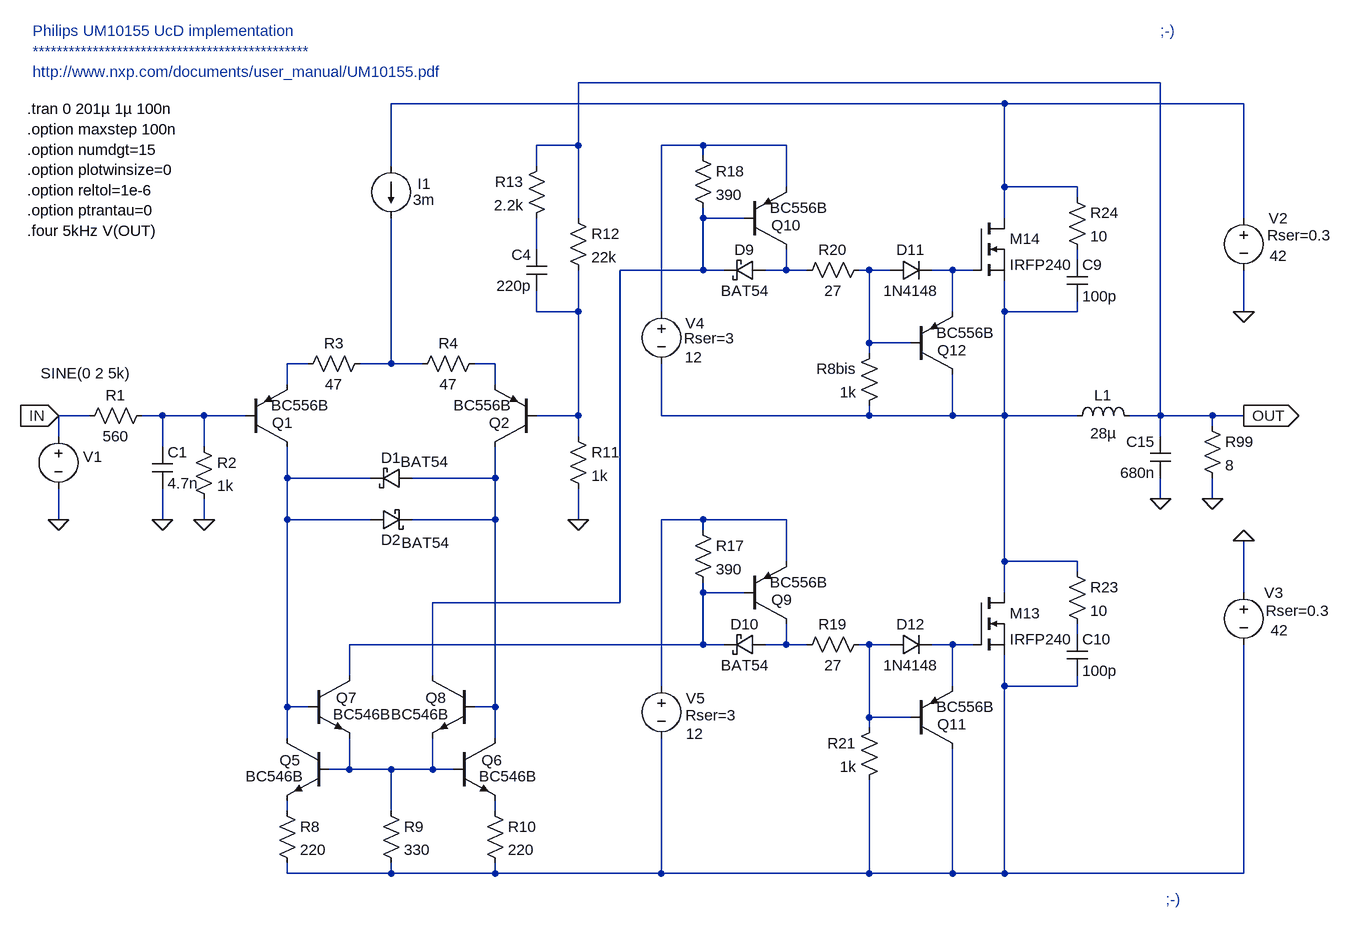
[diagram p0: schematic UcD simplified (5kHz .tran 0 201µ 1µ 100n).asc]
UcD simplified (5kHz .tran 0 201µ 1µ 100n).asc, the LTspice schematic file:
Version 4
SHEET 1 2660 1008
WIRE 1120 -352 224 -352
WIRE 880 -320 -64 -320
WIRE 1248 -320 880 -320
WIRE 224 -256 224 -352
WIRE 224 -256 160 -256
WIRE 416 -256 352 -256
WIRE 544 -256 416 -256
WIRE 416 -240 416 -256
WIRE -64 -224 -64 -320
WIRE 160 -224 160 -256
WIRE 544 -192 544 -256
WIRE 880 -192 880 -320
WIRE 992 -192 880 -192
WIRE 992 -176 992 -192
WIRE 224 -144 224 -256
WIRE 416 -144 416 -160
WIRE 480 -144 416 -144
WIRE 880 -144 880 -192
WIRE 1248 -144 1248 -320
WIRE 160 -96 160 -144
WIRE 992 -80 992 -96
WIRE 416 -64 416 -144
WIRE 416 -64 288 -64
WIRE 448 -64 416 -64
WIRE 544 -64 544 -96
WIRE 544 -64 512 -64
WIRE 576 -64 544 -64
WIRE 672 -64 656 -64
WIRE 704 -64 672 -64
WIRE 800 -64 768 -64
WIRE 832 -64 800 -64
WIRE 160 0 160 -32
WIRE 224 0 224 -64
WIRE 224 0 160 0
WIRE 352 0 352 -256
WIRE 800 0 800 -64
WIRE 880 0 880 -48
WIRE 992 0 992 -16
WIRE 992 0 880 0
WIRE 1248 0 1248 -64
WIRE 672 48 672 -64
WIRE 736 48 672 48
WIRE 672 64 672 48
WIRE -192 80 -224 80
WIRE -64 80 -64 -144
WIRE -64 80 -112 80
WIRE -16 80 -64 80
WIRE 96 80 64 80
WIRE -224 112 -224 80
WIRE 96 112 96 80
WIRE -528 160 -576 160
WIRE -416 160 -448 160
WIRE -352 160 -416 160
WIRE -288 160 -352 160
WIRE 224 160 224 0
WIRE 224 160 160 160
WIRE 352 160 352 80
WIRE 672 160 672 144
WIRE 672 160 352 160
WIRE 800 160 800 96
WIRE 800 160 672 160
WIRE 880 160 880 0
WIRE 880 160 800 160
WIRE 992 160 880 160
WIRE 1120 160 1120 -352
WIRE 1120 160 1072 160
WIRE 1200 160 1120 160
WIRE 1248 160 1200 160
WIRE 1200 176 1200 160
WIRE -576 192 -576 160
WIRE 224 192 224 160
WIRE 1120 192 1120 160
WIRE -416 208 -416 160
WIRE -352 208 -352 160
WIRE -224 256 -224 208
WIRE -96 256 -224 256
WIRE 96 256 96 208
WIRE 96 256 -32 256
WIRE 1120 288 1120 256
WIRE 1200 288 1200 256
WIRE -576 320 -576 272
WIRE -416 320 -416 272
WIRE -352 320 -352 288
WIRE -224 320 -224 256
WIRE -96 320 -224 320
WIRE 96 320 96 256
WIRE 96 320 -32 320
WIRE 224 320 224 272
WIRE 416 320 352 320
WIRE 544 320 416 320
WIRE 416 336 416 320
WIRE 544 384 544 320
WIRE 880 384 880 160
WIRE 992 384 880 384
WIRE 992 400 992 384
WIRE 416 432 416 416
WIRE 480 432 416 432
WIRE 880 432 880 384
WIRE 1248 432 1248 352
WIRE 288 448 288 -64
WIRE 288 448 0 448
WIRE 992 496 992 480
WIRE 416 512 416 432
WIRE 416 512 -128 512
WIRE 448 512 416 512
WIRE 544 512 544 480
WIRE 544 512 512 512
WIRE 576 512 544 512
WIRE 672 512 656 512
WIRE 704 512 672 512
WIRE 800 512 768 512
WIRE 832 512 800 512
WIRE -128 560 -128 512
WIRE 0 560 0 448
WIRE 352 576 352 320
WIRE 800 576 800 512
WIRE 880 576 880 528
WIRE 992 576 992 560
WIRE 992 576 880 576
WIRE -224 608 -224 320
WIRE -192 608 -224 608
WIRE 96 608 96 320
WIRE 96 608 64 608
WIRE 672 624 672 512
WIRE 736 624 672 624
WIRE 672 640 672 624
WIRE -224 656 -224 608
WIRE 96 656 96 608
WIRE -128 704 -128 656
WIRE -128 704 -160 704
WIRE -64 704 -128 704
WIRE 0 704 0 656
WIRE 0 704 -64 704
WIRE 32 704 0 704
WIRE -224 768 -224 752
WIRE -64 768 -64 704
WIRE 96 768 96 752
WIRE -224 864 -224 848
WIRE -64 864 -64 848
WIRE -64 864 -224 864
WIRE 96 864 96 848
WIRE 96 864 -64 864
WIRE 352 864 352 656
WIRE 352 864 96 864
WIRE 672 864 672 720
WIRE 672 864 352 864
WIRE 800 864 800 672
WIRE 800 864 672 864
WIRE 880 864 880 576
WIRE 880 864 800 864
WIRE 1248 864 1248 512
WIRE 1248 864 880 864
FLAG 1120 288 0
FLAG -576 320 0
FLAG 1200 288 0
FLAG -416 320 0
FLAG -352 320 0
FLAG 224 320 0
FLAG 1248 0 0
FLAG 1248 352 0
FLAG -576 160 IN
IOPIN -576 160 In
FLAG 1248 160 OUT
IOPIN 1248 160 Out
SYMBOL voltage -576 176 R0
WINDOW 3 111 -81 Right 0
WINDOW 123 0 0 Left 0
WINDOW 39 0 0 Left 0
WINDOW 0 38 47 Left 0
SYMATTR Value SINE(0 2 5k)
SYMATTR InstName V1
SYMBOL ind 976 176 R270
WINDOW 0 32 56 VTop 0
WINDOW 3 5 56 VBottom 0
SYMATTR InstName L1
SYMATTR Value 28µ
SYMBOL cap 1136 192 M0
SYMATTR InstName C15
SYMATTR Value 680n
SYMBOL voltage 1248 -160 R0
WINDOW 123 0 0 Left 0
WINDOW 39 36 42 Left 0
WINDOW 0 39 16 Left 0
WINDOW 3 40 74 Left 0
SYMATTR SpiceLine Rser=0.3
SYMATTR InstName V2
SYMATTR Value 42
SYMBOL voltage 1248 416 R0
WINDOW 123 0 0 Left 0
WINDOW 39 34 44 Left 0
WINDOW 0 32 16 Left 0
WINDOW 3 42 74 Left 0
SYMATTR SpiceLine Rser=0.3
SYMATTR InstName V3
SYMATTR Value 42
SYMBOL res 1184 160 R0
SYMATTR InstName R99
SYMATTR Value 8
SYMBOL npn 32 656 R0
WINDOW 0 43 34 Left 0
WINDOW 3 39 59 Left 0
SYMATTR InstName Q6
SYMATTR Value BC546B
SYMBOL pnp 160 208 R180
WINDOW 0 41 37 Left 0
WINDOW 3 39 64 Left 0
SYMATTR InstName Q2
SYMATTR Value BC556B
SYMBOL pnp -288 208 M180
WINDOW 0 41 37 Left 0
WINDOW 3 39 64 Left 0
SYMATTR InstName Q1
SYMATTR Value BC556B
SYMBOL res -96 64 R90
WINDOW 0 0 56 VBottom 0
WINDOW 3 32 56 VTop 0
SYMATTR InstName R3
SYMATTR Value 47
SYMBOL res 80 64 R90
WINDOW 0 0 56 VBottom 0
WINDOW 3 32 56 VTop 0
SYMATTR InstName R4
SYMATTR Value 47
SYMBOL npn -160 656 M0
WINDOW 0 43 34 Left 0
WINDOW 3 39 59 Left 0
SYMATTR InstName Q5
SYMATTR Value BC546B
SYMBOL npn -192 560 R0
WINDOW 0 43 34 Left 0
WINDOW 3 39 59 Left 0
SYMATTR InstName Q7
SYMATTR Value BC546B
SYMBOL npn 64 560 M0
WINDOW 0 43 34 Left 0
WINDOW 3 39 59 Left 0
SYMATTR InstName Q8
SYMATTR Value BC546B
SYMBOL res -80 752 R0
SYMATTR InstName R9
SYMATTR Value 330
SYMBOL res -240 752 R0
SYMATTR InstName R8
SYMATTR Value 220
SYMBOL res 80 752 R0
SYMATTR InstName R10
SYMATTR Value 220
SYMBOL schottky -32 240 R90
WINDOW 0 0 32 VBottom 0
WINDOW 3 -25 -19 VTop 0
SYMATTR InstName D1
SYMATTR Value BAT54
SYMBOL schottky -96 304 M90
WINDOW 0 62 32 VBottom 0
WINDOW 3 36 85 VTop 0
SYMATTR InstName D2
SYMATTR Value BAT54
SYMBOL current -64 -224 R0
WINDOW 0 41 27 Left 0
WINDOW 3 34 52 Left 0
WINDOW 123 0 0 Left 0
WINDOW 39 0 0 Left 0
SYMATTR InstName I1
SYMATTR Value 3m
SYMBOL res -368 192 R0
SYMATTR InstName R2
SYMATTR Value 1k
SYMBOL cap -432 208 R0
SYMATTR InstName C1
SYMATTR Value 4.7n
SYMBOL res -432 144 R90
WINDOW 0 0 56 VBottom 0
WINDOW 3 32 56 VTop 0
SYMATTR InstName R1
SYMATTR Value 560
SYMBOL schottky 512 -80 R90
WINDOW 0 0 32 VBottom 0
WINDOW 3 32 32 VTop 0
SYMATTR InstName D9
SYMATTR Value BAT54
SYMBOL pnp 480 -96 M180
WINDOW 0 41 37 Left 0
WINDOW 3 39 64 Left 0
SYMATTR InstName Q10
SYMATTR Value BC556B
SYMBOL res 400 -256 R0
SYMATTR InstName R18
SYMATTR Value 390
SYMBOL res 672 -80 R90
WINDOW 0 0 56 VBottom 0
WINDOW 3 32 56 VTop 0
SYMATTR InstName R20
SYMATTR Value 27
SYMBOL diode 704 -48 R270
WINDOW 0 32 32 VTop 0
WINDOW 3 0 32 VBottom 0
SYMATTR InstName D11
SYMATTR Value 1N4148
SYMBOL pnp 736 96 M180
WINDOW 0 41 37 Left 0
WINDOW 3 39 64 Left 0
SYMATTR InstName Q12
SYMATTR Value BC556B
SYMBOL res 688 48 M0
SYMATTR InstName R8bis
SYMATTR Value 1k
SYMBOL nmos 832 -144 R0
SYMATTR InstName M14
SYMATTR Value IRFP240
SYMBOL voltage 352 -16 R0
WINDOW 123 0 0 Left 0
WINDOW 39 35 57 Left 0
WINDOW 0 37 34 Left 0
WINDOW 3 36 86 Left 0
SYMATTR SpiceLine Rser=3
SYMATTR InstName V4
SYMATTR Value 12
SYMBOL schottky 512 496 R90
WINDOW 0 0 32 VBottom 0
WINDOW 3 32 32 VTop 0
SYMATTR InstName D10
SYMATTR Value BAT54
SYMBOL pnp 480 480 M180
WINDOW 0 41 37 Left 0
WINDOW 3 39 64 Left 0
SYMATTR InstName Q9
SYMATTR Value BC556B
SYMBOL res 400 320 R0
SYMATTR InstName R17
SYMATTR Value 390
SYMBOL res 672 496 R90
WINDOW 0 0 56 VBottom 0
WINDOW 3 32 56 VTop 0
SYMATTR InstName R19
SYMATTR Value 27
SYMBOL diode 704 528 R270
WINDOW 0 32 32 VTop 0
WINDOW 3 0 32 VBottom 0
SYMATTR InstName D12
SYMATTR Value 1N4148
SYMBOL pnp 736 672 M180
WINDOW 0 41 37 Left 0
WINDOW 3 39 64 Left 0
SYMATTR InstName Q11
SYMATTR Value BC556B
SYMBOL res 688 624 M0
SYMATTR InstName R21
SYMATTR Value 1k
SYMBOL nmos 832 432 R0
SYMATTR InstName M13
SYMATTR Value IRFP240
SYMBOL voltage 352 560 R0
WINDOW 123 0 0 Left 0
WINDOW 39 37 61 Left 0
WINDOW 0 38 35 Left 0
WINDOW 3 38 89 Left 0
SYMATTR SpiceLine Rser=3
SYMATTR InstName V5
SYMATTR Value 12
SYMBOL res 208 176 R0
SYMATTR InstName R11
SYMATTR Value 1k
SYMBOL res 208 -160 R0
SYMATTR InstName R12
SYMATTR Value 22k
SYMBOL res 176 -240 M0
SYMATTR InstName R13
SYMATTR Value 2.2k
SYMBOL cap 176 -96 M0
SYMATTR InstName C4
SYMATTR Value 220p
SYMBOL res 976 -192 R0
SYMATTR InstName R24
SYMATTR Value 10
SYMBOL cap 976 -80 R0
SYMATTR InstName C9
SYMATTR Value 100p
SYMBOL res 976 384 R0
SYMATTR InstName R23
SYMATTR Value 10
SYMBOL cap 976 496 R0
SYMATTR InstName C10
SYMATTR Value 100p
TEXT 1120 -432 Left 0 ;;-)
TEXT 1128 904 Left 0 ;;-)
TEXT -616 -432 Left 0 ;Philips UM10155 UcD implementation\n**********************************************\nhttp://www.nxp.com/documents/user_manual/UM10155.pdf
TEXT -624 -312 Left 0 !.tran 0 201µ 1µ 100n\n.option maxstep 100n\n.option numdgt=15\n.option plotwinsize=0\n.option reltol=1e-6\n.option ptrantau=0\n.four 5kHz V(OUT)

The netlist it stands for:
* UcD simplified (5kHz .tran 0 201µ 1µ 100n).asc
V1 IN 0 SINE(0 2 5k)
L1 N010 OUT 28µ
C15 OUT 0 680n
V2 N001 0 42 Rser=0.3
V3 0 N023 42 Rser=0.3
R99 OUT 0 8
Q6 N016 N024 N026 0 BC546B
Q2 N016 N009 N013 0 BC556B
Q1 N015 N014 N011 0 BC556B
R3 N012 N011 47
R4 N013 N012 47
Q5 N015 N024 N025 0 BC546B
Q7 N018 N015 N024 0 BC546B
Q8 N003 N016 N024 0 BC546B
R9 N024 N023 330
R8 N025 N023 220
R10 N026 N023 220
D1 N016 N015 BAT54
D2 N015 N016 BAT54
I1 N001 N012 3m
R2 N014 0 1k
C1 N014 0 4.7n
R1 N014 IN 560
D9 N006 N003 BAT54
Q10 N006 N003 N002 0 BC556B
R18 N002 N003 390
R20 N007 N006 27
D11 N007 N008 1N4148
Q12 N010 N007 N008 0 BC556B
R8bis N007 N010 1k
M14 N001 N008 N010 N010 IRFP240
V4 N002 N010 12 Rser=3
D10 N020 N018 BAT54
Q9 N020 N018 N017 0 BC556B
R17 N017 N018 390
R19 N021 N020 27
D12 N021 N022 1N4148
Q11 N023 N021 N022 0 BC556B
R21 N021 N023 1k
M13 N010 N022 N023 N023 IRFP240
V5 N017 N023 12 Rser=3
R11 N009 0 1k
R12 OUT N009 22k
R13 OUT N004 2.2k
C4 N004 N009 220p
R24 N001 N005 10
C9 N005 N010 100p
R23 N010 N019 10
C10 N019 N023 100p
.model D D
.lib standard.dio
.model NPN NPN
.model PNP PNP
.lib standard.bjt
.model NMOS NMOS
.model PMOS PMOS
.lib standard.mos
* ;-)
* ;-)
* Philips UM10155 UcD implementation
* **********************************************
* http://www.nxp.com/documents/user_manual/UM10155.pdf
.tran 0 201µ 1µ 100n
.option maxstep 100n
.option numdgt=15
.option plotwinsize=0
.option reltol=1e-6
.option ptrantau=0
.four 5kHz V(OUT)
.backanno
.end